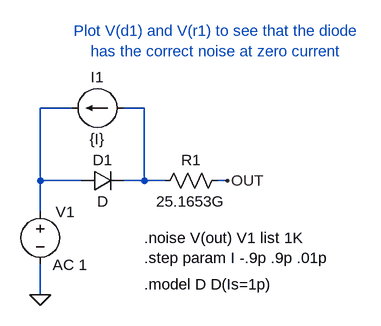
[diagram p0: schematic DiodeSim2.asc]
DiodeSim2.asc, the LTspice schematic file:
Version 4
SHEET 1 880 680
WIRE -48 -64 -96 -64
WIRE 64 -64 32 -64
WIRE -96 48 -96 -64
WIRE -32 48 -96 48
WIRE 64 48 64 -64
WIRE 64 48 32 48
WIRE 96 48 64 48
WIRE 192 48 176 48
WIRE -96 96 -96 48
WIRE -96 224 -96 176
FLAG 192 48 OUT
FLAG -96 224 0
SYMBOL diode -32 64 R270
WINDOW 0 32 32 VTop 0
WINDOW 3 0 32 VBottom 0
SYMATTR InstName D1
SYMBOL voltage -96 80 R0
WINDOW 123 19 98 Left 0
SYMATTR Value ""
SYMATTR Value2 AC 1
SYMATTR InstName V1
SYMBOL current 32 -64 R90
WINDOW 0 -32 40 VBottom 0
WINDOW 3 32 40 VTop 0
SYMATTR InstName I1
SYMATTR Value {I}
SYMBOL res 80 64 R270
WINDOW 0 32 56 VTop 0
WINDOW 3 0 56 VBottom 0
SYMATTR InstName R1
SYMATTR Value 25.1653G
TEXT 64 136 Left 0 !.noise V(out) V1 list 1K\n.step param I -.9p .9p .01p
TEXT 64 208 Left 0 !.model D D(Is=1p)
TEXT 176 -136 Bottom 0 ;Plot V(d1) and V(r1) to see that the diode\nhas the correct noise at zero current

The netlist it stands for:
* DiodeSim2.asc
D1 N001 N002 D
V1 N001 0 AC 1
I1 N002 N001 {I}
R1 N002 OUT 25.1653G
.model D D
.lib standard.dio
.noise V(out) V1 list 1K
.step param I -.9p .9p .01p
.model D D(Is=1p)
* Plot V(d1) and V(r1) to see that the diode
* has the correct noise at zero current
.backanno
.end